# EAGLE design controller (EAGLE 5.12)
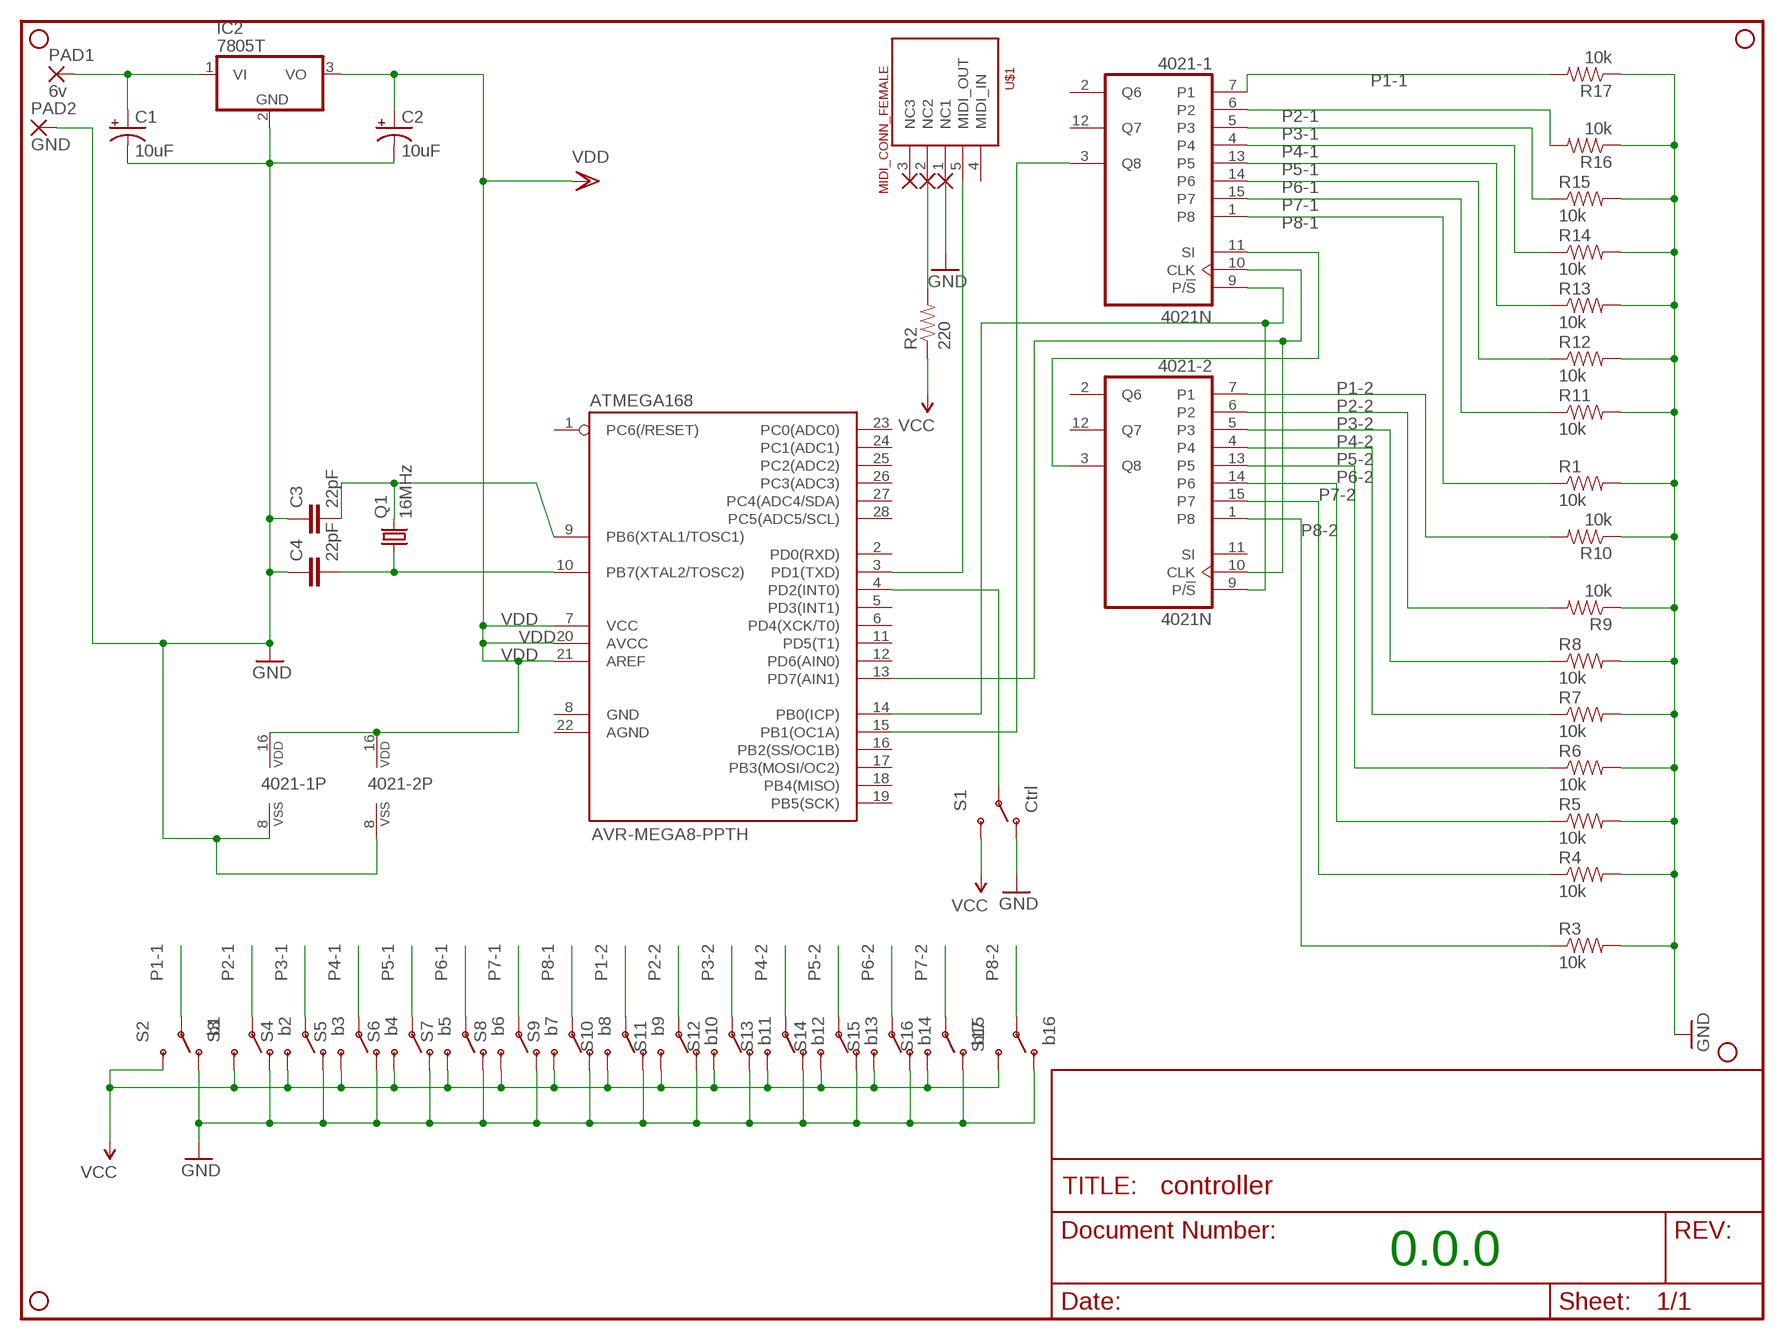
[diagram p0: schematic, sheet 1]

## Parts
4021-1  4021N  [DIL16]
4021-2  4021N  [DIL16]
ATMEGA168  AVR-MEGA8-PPTH  [DIL28-3]
C1  10uF  CAP_POLPTH2  [CPOL-RADIAL-10UF-25V]
C2  10uF  CAP_POLPTH2  [CPOL-RADIAL-10UF-25V]
C3  22pF  CAPKIT  [CAP-PTH-SMALL-KIT]
C4  22pF  CAPKIT  [CAP-PTH-SMALL-KIT]
IC2  7805T  [TO220H]
JP1  STAND-OFF  [STAND-OFF]
JP2  STAND-OFF  [STAND-OFF]
JP3  STAND-OFF  [STAND-OFF]
JP4  STAND-OFF  [STAND-OFF]
PAD1  6v  2,54/1,1  [2,54/1,1]
PAD2  GND  2,54/1,1  [2,54/1,1]
Q1  16MHz  CRYSTALHC49U70  [HC49U70]
R1  10k  RESISTORAXIAL-0.3  [AXIAL-0.3]
R2  220  RESISTORAXIAL-0.3  [AXIAL-0.3]
R3  10k  RESISTORAXIAL-0.3  [AXIAL-0.3]
R4  10k  RESISTORAXIAL-0.3  [AXIAL-0.3]
R5  10k  RESISTORAXIAL-0.3  [AXIAL-0.3]
R6  10k  RESISTORAXIAL-0.3  [AXIAL-0.3]
R7  10k  RESISTORAXIAL-0.3  [AXIAL-0.3]
R8  10k  RESISTORAXIAL-0.3  [AXIAL-0.3]
R9  10k  RESISTORAXIAL-0.3  [AXIAL-0.3]
R10  10k  RESISTORAXIAL-0.3  [AXIAL-0.3]
R11  10k  RESISTORAXIAL-0.3  [AXIAL-0.3]
R12  10k  RESISTORAXIAL-0.3  [AXIAL-0.3]
R13  10k  RESISTORAXIAL-0.3  [AXIAL-0.3]
R14  10k  RESISTORAXIAL-0.3  [AXIAL-0.3]
R15  10k  RESISTORAXIAL-0.3  [AXIAL-0.3]
R16  10k  RESISTORAXIAL-0.3  [AXIAL-0.3]
R17  10k  RESISTORAXIAL-0.3  [AXIAL-0.3]
S1  Ctrl  SWITCH-SPSTKIT  [SWITCH-SPDT_KIT]
S2  b1  SWITCH-SPSTKIT  [SWITCH-SPDT_KIT]
S3  b2  SWITCH-SPSTKIT  [SWITCH-SPDT_KIT]
S4  b3  SWITCH-SPSTKIT  [SWITCH-SPDT_KIT]
S5  b4  SWITCH-SPSTKIT  [SWITCH-SPDT_KIT]
S6  b5  SWITCH-SPSTKIT  [SWITCH-SPDT_KIT]
S7  b6  SWITCH-SPSTKIT  [SWITCH-SPDT_KIT]
S8  b7  SWITCH-SPSTKIT  [SWITCH-SPDT_KIT]
S9  b8  SWITCH-SPSTKIT  [SWITCH-SPDT_KIT]
S10  b9  SWITCH-SPSTKIT  [SWITCH-SPDT_KIT]
S11  b10  SWITCH-SPSTKIT  [SWITCH-SPDT_KIT]
S12  b11  SWITCH-SPSTKIT  [SWITCH-SPDT_KIT]
S13  b12  SWITCH-SPSTKIT  [SWITCH-SPDT_KIT]
S14  b13  SWITCH-SPSTKIT  [SWITCH-SPDT_KIT]
S15  b14  SWITCH-SPSTKIT  [SWITCH-SPDT_KIT]
S16  b15  SWITCH-SPSTKIT  [SWITCH-SPDT_KIT]
S17  b16  SWITCH-SPSTKIT  [SWITCH-SPDT_KIT]
U$1  MIDI_CONN_FEMALE  [DIN_5_FEMALE]

## Nets
GND: 4021-1.8(VSS) 4021-2.8(VSS) C1.2(-) C2.2(-) C3.1 C4.1 IC2.2(GND) PAD2.1(P) R1.P$2 R3.P$2 R4.P$2 R5.P$2 R6.P$2 R7.P$2 R8.P$2 R9.P$1 R10.P$1 R11.P$2 R12.P$2 R13.P$2 R14.P$2 R15.P$2 R16.P$1 R17.P$1 S1.1(O) S2.1(O) S3.1(O) S4.1(O) S5.1(O) S6.1(O) S7.1(O) S8.1(O) S9.1(O) S10.1(O) S11.1(O) S12.1(O) S13.1(O) S14.1(O) S15.1(O) S16.1(O) S17.1(O) U$1.1(NC1)
N$1: ATMEGA168.3(PD1(TXD)) U$1.5(MIDI_OUT)
N$2: R2.P$2 U$1.2(NC2)
N$3: ATMEGA168.4(PD2(INT0)) S1.2(P)
N$4: C1.1(+) IC2.1(VI) PAD1.1(P)
N$5: 4021-1.3(Q8) ATMEGA168.15(PB1(OC1A))
N$6: ATMEGA168.9(PB6(XTAL1/TOSC1)) C3.2 Q1.2
N$7: ATMEGA168.10(PB7(XTAL2/TOSC2)) C4.2 Q1.1
N$8: 4021-1.10(CLK) 4021-2.10(CLK) ATMEGA168.13(PD7(AIN1))
N$9: 4021-1.9(P/!S) 4021-2.9(P/!S) ATMEGA168.14(PB0(ICP))
N$10: 4021-1.11(SI) 4021-2.3(Q8)
P1-1: 4021-1.7(P1) R17.P$2 S2.2(P)
P1-2: 4021-2.7(P1) R10.P$2 S10.2(P)
P2-1: 4021-1.6(P2) R16.P$2 S3.2(P)
P2-2: 4021-2.6(P2) R9.P$2 S11.2(P)
P3-1: 4021-1.5(P3) R15.P$1 S4.2(P)
P3-2: 4021-2.5(P3) R8.P$1 S12.2(P)
P4-1: 4021-1.4 R14.P$1 S5.2(P)
P4-2: 4021-2.4 R7.P$1 S13.2(P)
P5-1: 4021-1.13(P5) R13.P$1 S6.2(P)
P5-2: 4021-2.13(P5) R6.P$1 S14.2(P)
P6-1: 4021-1.14(P6) R12.P$1 S7.2(P)
P6-2: 4021-2.14(P6) R5.P$1 S15.2(P)
P7-1: 4021-1.15(P7) R11.P$1 S8.2(P)
P7-2: 4021-2.15(P7) R4.P$1 S16.2(P)
P8-1: 4021-1.1(P8) R1.P$1 S9.2(P)
P8-2: 4021-2.1(P8) R3.P$1 S17.2(P)
VCC: R2.P$1 S1.3(S) S2.3(S) S3.3(S) S4.3(S) S5.3(S) S6.3(S) S7.3(S) S8.3(S) S9.3(S) S10.3(S) S11.3(S) S12.3(S) S13.3(S) S14.3(S) S15.3(S) S16.3(S) S17.3(S)
VDD: 4021-1.16(VDD) 4021-2.16(VDD) ATMEGA168.7(VCC) ATMEGA168.20(AVCC) ATMEGA168.21(AREF) C2.1(+) IC2.3(VO)
Unconnected: 4021-1.2(Q6) 4021-1.12(Q7) 4021-2.2(Q6) 4021-2.11(SI) 4021-2.12(Q7) ATMEGA168.1(PC6(/RESET)) ATMEGA168.2(PD0(RXD)) ATMEGA168.5(PD3(INT1)) ATMEGA168.6(PD4(XCK/T0)) ATMEGA168.8(GND) ATMEGA168.11(PD5(T1)) ATMEGA168.12(PD6(AIN0)) ATMEGA168.16(PB2(SS/OC1B)) ATMEGA168.17(PB3(MOSI/OC2)) ATMEGA168.18(PB4(MISO)) ATMEGA168.19(PB5(SCK)) ATMEGA168.22(AGND) ATMEGA168.23(PC0(ADC0)) ATMEGA168.24(PC1(ADC1)) ATMEGA168.25(PC2(ADC2)) ATMEGA168.26(PC3(ADC3)) ATMEGA168.27(PC4(ADC4/SDA)) ATMEGA168.28(PC5(ADC5/SCL)) U$1.3(NC3) U$1.4(MIDI_IN)

## Notes on the sheet
- 0.0.0

## Library data of the parts
4021-1 4021-2 = 40xx:4021: 8-bit static SHIFT REGISTER
ATMEGA168 = SparkFun:AVR-MEGA8-P: MICROCONTROLLER 8 Kbytes FLASH 1 kbytes SRAM 512 bytes EEPROM USART 4-channel 10 bit ADC 2-channel 8 bit ADC
C1 C2 = SparkFun:CAP_POL: Capacitor Polarized These are standard SMD and PTH capacitors. Normally 10uF, 47uF, and 100uF in electrolytic and tantalum varieties. Always verify the external diameter of the through hole cap, it varies with capacity, voltage, and manufacturer. The EIA devices should be standard.
C3 C4 = SparkFun:CAP: Capacitor Standard 0603 ceramic capacitor, and 0.1" leaded capacitor.
IC2 = linear:78*: Positive VOLTAGE REGULATOR Source: http://cache.national.com/ds/LM/LM78L05.pdf http://www.fairchildsemi.com/ds/LM/LM7805.pdf
JP1-JP4 = SparkFun:STAND-OFF: Stand Off This is the mechanical footprint for a #4 phillips button head screw. Use the keepout ring to avoid running the screw head into surrounding components. SKU : PRT-00447
PAD1 PAD2 = wirepad:2,54/1,1: THROUGH-HOLE PAD
Q1 = crystal:CRYSTAL: CRYSTAL; OC_FARNELL: unknown; OC_NEWARK: unknown
R1-R17 = SparkFun:RESISTOR: Resistor Basic schematic elements and footprints for 0603, 1206, and PTH resistors.
S1-S17 = SparkFun:SWITCH-SPST: SPST Switch Simple slide switch. Spark Fun Electronics SKU : COM-00102
U$1 = SparkFun:MIDI_CONN_FEMALE

## Board
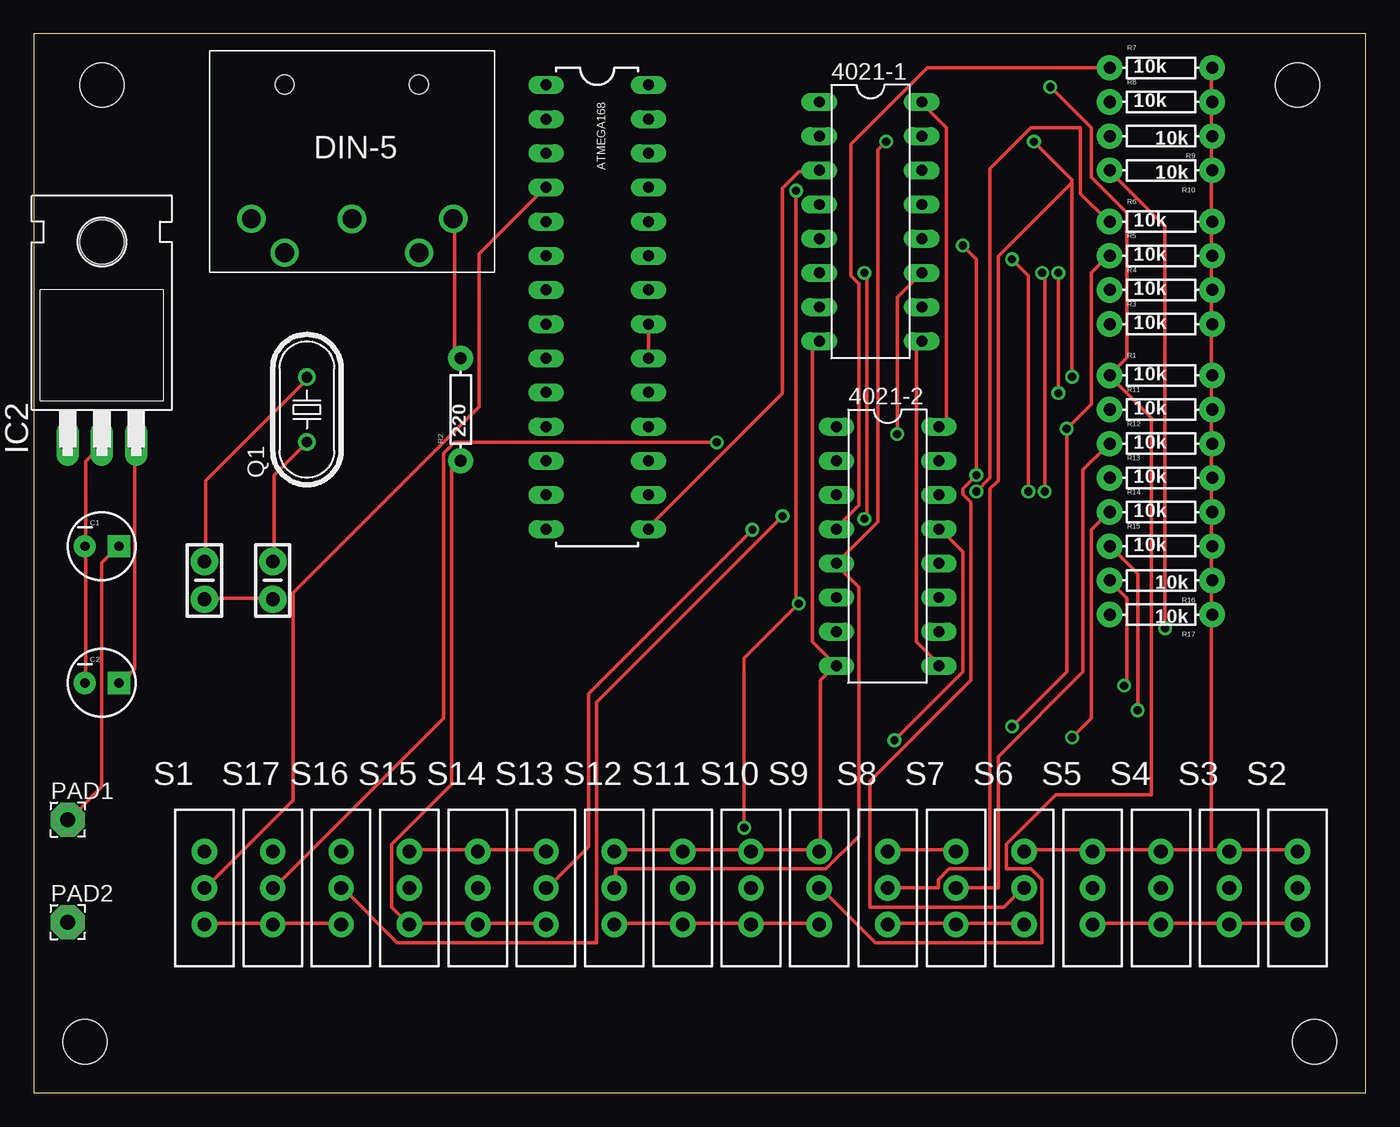
[diagram p1: board, top side]
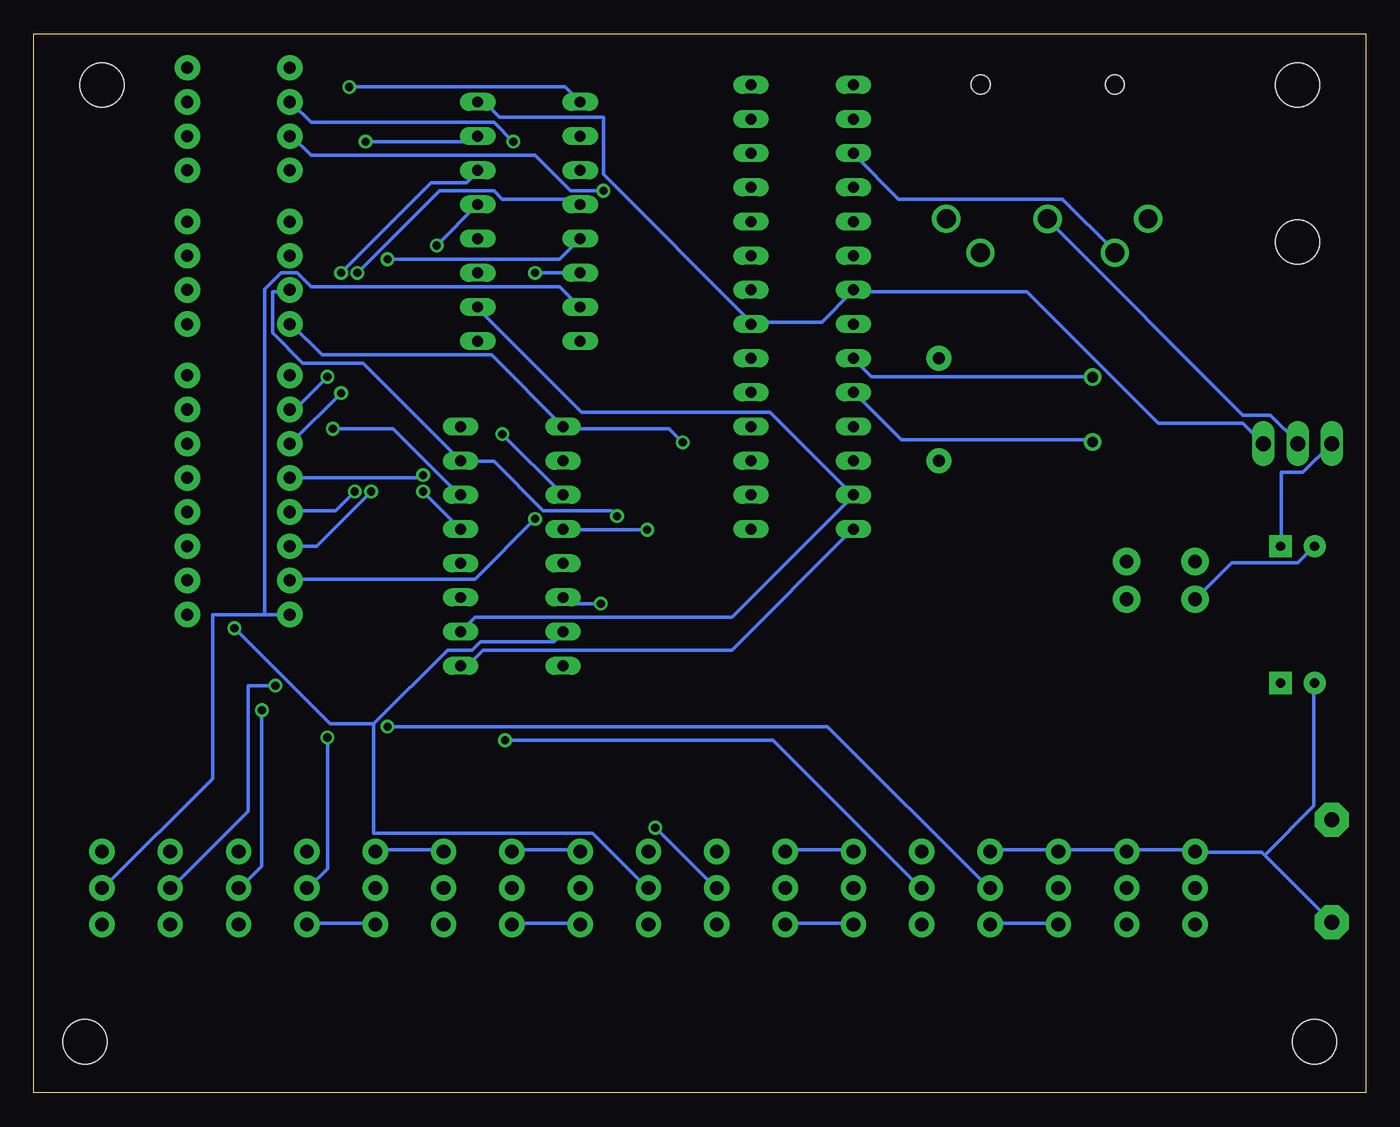
[diagram p2: board, bottom side, seen from below]

Size 99.06 x 78.74 mm. Coordinates in mm from the lower left corner, seen from the top.
Outline: 0,0 99.06,0 99.06,78.74 0,78.74 0,0
Copper layers (1*16): Top 0.035mm / dielectric 1.5mm / Bottom 0.035mm
Design rules "default": minimum track width 10mil, minimum drill 24mil, track to track 8mil, track to pad 8mil, pad to pad 8mil, via to via 8mil, smd to smd 8mil, copper to edge 40mil, drill to drill 8mil, minimum pad ring 10mil, minimum via ring 8mil, stop-mask expansion 4mil, vias tented up to drill 0mil, thermal gap 10mil

### Footprints (pad centres in the part's own frame; a part is rotated, then mirrored left to right if it is on the bottom)
DIL16 = drill 0.813 long: 1 -8.89,-3.81; 2 -6.35,-3.81; 3 -3.81,-3.81; 4 -1.27,-3.81; 5 1.27,-3.81; 6 3.81,-3.81; 7 6.35,-3.81; 8 8.89,-3.81; 9 8.89,3.81; 10 6.35,3.81; 11 3.81,3.81; 12 1.27,3.81; 13 -1.27,3.81; 14 -3.81,3.81; 15 -6.35,3.81; 16 -8.89,3.81
DIL28-3 = drill 0.813 long: 1 -16.51,-3.81; 2 -13.97,-3.81; 3 -11.43,-3.81; 4 -8.89,-3.81; 5 -6.35,-3.81; 6 -3.81,-3.81; 7 -1.27,-3.81; 8 1.27,-3.81; 9 3.81,-3.81; 10 6.35,-3.81; 11 8.89,-3.81; 12 11.43,-3.81; 13 13.97,-3.81; 14 16.51,-3.81; 15 16.51,3.81; 16 13.97,3.81; 17 11.43,3.81; 18 8.89,3.81; 19 6.35,3.81; 20 3.81,3.81; 21 1.27,3.81; 22 -1.27,3.81; 23 -3.81,3.81; 24 -6.35,3.81; 25 -8.89,3.81; 26 -11.43,3.81; 27 -13.97,3.81; 28 -16.51,3.81
CPOL-RADIAL-10UF-25V = drill 0.7 pad 1.651 square: 1 1.27,0 | drill 0.7 pad 1.651 round: 2 -1.27,0
CAP-PTH-SMALL-KIT = drill 1.016 pad 2.032 round: 1 -1.397,0; 2 1.397,0
TO220H = drill 1.118 long: 1 -2.54,-10.16; 2 0,-10.16; 3 2.54,-10.16 | hole 3.302: 0,4.826
STAND-OFF = hole 3.302: 0,0
2,54/1,1 = drill 1.118 pad 2.54 octagon: 1 0,0
HC49U70 = drill 0.813 round: 1 -2.413,0; 2 2.413,0
AXIAL-0.3 = drill 0.9 pad 1.88 round: P$1 -3.81,0; P$2 3.81,0
SWITCH-SPDT_KIT = drill 1.016 pad 1.88 round: 1 0,2.718; 2 0,0; 3 0,-2.718
DIN_5_FEMALE = drill 1.4 round: 1 0.46,3.61; 2 -7.07,3.6; 3 7.94,3.6; 4 -4.53,6.12; 5 5.47,6.13 | hole 1.4: -4.52,-6.38; 5.47,-6.38

### Placement (x,y rotation side)
4021-1  62.23,64.77 270 top
4021-2  63.5,40.64 270 top
ATMEGA168  41.91,58.42 270 top
C1  5.08,40.64 0 top
C2  5.08,30.48 0 top
C3  12.7,38.1 90 top
C4  17.78,38.1 90 top
IC2  5.08,58.42 0 top
JP1  3.81,3.81 0 top
JP2  93.98,74.93 0 top
JP3  95.25,3.81 0 top
JP4  5.08,74.93 0 top
PAD1  2.54,20.32 0 top
PAD2  2.54,12.7 0 top
Q1  20.32,50.8 90 top
R1  83.82,53.34 0 top
R2  31.75,50.8 90 top
R3  83.82,57.15 0 top
R4  83.82,59.69 0 top
R5  83.82,62.23 0 top
R6  83.82,64.77 0 top
R7  83.82,76.2 0 top
R8  83.82,73.66 0 top
R9  83.82,71.12 180 top
R10  83.82,68.58 180 top
R11  83.82,50.8 0 top
R12  83.82,48.26 0 top
R13  83.82,45.72 0 top
R14  83.82,43.18 0 top
R15  83.82,40.64 0 top
R16  83.82,38.1 180 top
R17  83.82,35.56 180 top
S1  12.7,15.24 0 top
S2  93.98,15.24 0 top
S3  88.9,15.24 0 top
S4  83.82,15.24 0 top
S5  78.74,15.24 0 top
S6  73.66,15.24 0 top
S7  68.58,15.24 0 top
S8  63.5,15.24 0 top
S9  58.42,15.24 0 top
S10  53.34,15.24 0 top
S11  48.26,15.24 0 top
S12  43.18,15.24 0 top
S13  38.1,15.24 0 top
S14  33.02,15.24 0 top
S15  27.94,15.24 0 top
S16  22.86,15.24 0 top
S17  17.78,15.24 0 top
U$1  24.13,68.58 180 top

### Tracks (layer width: path | path; a pad name or v marks a point on that pad's centre or on a via)
GND
  Top 0.254: C3.1 12.8,36.78 17.68,36.78 C4.1 | 3.86,40.64 3.86,30.48 C2.2 | 3.86,40.64 3.86,46.94 5.08,48.16 IC2.2 | 3.86,40.64 C1.2 | S12.1 43.28,18.09 48.16,18.09 S11.1 48.36,18.09 53.24,18.09 S10.1 53.44,18.09 58.32,18.09 S9.1 58.52,18.09 58.52,30.68 59.54,31.7 4021-2.8 57.91,33.53 57.91,55.47 58.32,55.88 4021-1.8 | S13.1 38,18.09 33.12,18.09 S14.1 32.92,18.09 28.04,18.09 S15.1 | 87.58,71.12 87.58,68.68 R10.P$1 87.58,68.48 87.58,64.82 R6.P$2 87.58,64.62 87.58,62.38 R5.P$2 87.58,62.18 87.58,59.74 R4.P$2 87.58,59.54 87.58,57.3 R3.P$2 87.58,57.1 87.58,53.44 R1.P$2 87.58,53.24 87.58,50.8 | R7.P$2 87.58,76.2 87.58,73.76 R8.P$2 87.58,73.56 87.58,71.12 | 87.58,71.12 R9.P$1 | 87.58,45.72 87.58,48.16 R12.P$2 87.58,48.36 87.58,50.8 | 87.58,35.56 87.58,38 R16.P$1 87.58,38.2 87.58,40.64 | 87.58,40.64 87.58,43.08 R14.P$2 87.58,43.28 87.58,45.72 | 87.58,40.64 R15.P$2 | 87.58,45.72 R13.P$2 | 87.58,50.8 R11.P$2 | 87.58,18.09 88.8,18.09 S3.1 89,18.09 93.88,18.09 S2.1 | 87.58,18.09 83.92,18.09 S4.1 83.72,18.09 78.84,18.09 S5.1 78.64,18.09 73.76,18.09 S6.1 | S8.1 63.6,18.09 68.48,18.09 S7.1 | 87.58,18.09 87.58,35.56 | 87.58,35.56 R17.P$1
  Bottom 0.254: U$1.1 23.57,64.82 9.14,50.39 7.11,50.39 5.08,48.36 IC2.2 | C3.1 12.6,36.78 9.96,39.42 5.08,39.42 3.86,40.64 C1.2 | S15.1 27.84,18.09 22.96,18.09 S16.1 22.76,18.09 17.88,18.09 S17.1 17.68,18.09 12.8,18.09 S1.1 12.6,17.88 7.72,17.88 7.52,17.68 | PAD2.1 7.52,17.68 | S12.1 43.08,18.09 38.2,18.09 S13.1 | S8.1 63.4,18.09 58.52,18.09 S9.1 | S6.1 73.56,18.09 68.68,18.09 S7.1 | 7.52,17.68 3.86,21.34 3.86,30.48 C2.2
N$1
  Bottom 0.254: ATMEGA168.3 38,69.7 34.75,66.45 22.55,66.45 18.69,62.59 U$1.5
N$2
  Top 0.254: R2.P$2 31.29,55.07 31.29,64.82 U$1.2
N$3
  Top 0.254: ATMEGA168.4 38,67.26 33.12,62.38 33.12,51 19.3,37.19 19.3,21.74 12.8,15.24 S1.2
N$4
  Top 0.254: PAD1.1 2.64,20.32 5.08,22.76 5.08,39.42 6.3,40.64 C1.1
  Bottom 0.254: C1.1 6.3,40.64 6.3,46.13 4.67,46.13 IC2.1
N$5
  Top 0.254: ATMEGA168.15 45.72,42.06 55.68,52.02 55.68,67.26 56.9,68.48 58.32,68.48 4021-1.3
N$6
  Top 0.254: Q1.2 20.32,53.03 12.8,45.52 12.8,39.62 C3.2
  Bottom 0.254: ATMEGA168.9 38,54.46 36.78,53.24 20.32,53.24 Q1.2
N$7
  Top 0.254: Q1.1 20.32,48.36 17.88,45.92 17.88,39.62 C4.2
  Bottom 0.254: ATMEGA168.10 38,52.02 34.54,48.56 20.32,48.56 Q1.1
N$8
  Bottom 0.254: 4021-2.10 66.24,35.36 47.14,35.36 38.2,44.3 ATMEGA168.13 38.2,44.5 44.3,50.6 58.32,50.6 66.04,58.32 4021-1.10
N$9
  Top 0.254: 4021-1.9 65.63,55.47 65.63,33.53 67.26,31.9 4021-2.9
  Bottom 0.254: ATMEGA168.14 38.2,41.86 47.14,32.92 65.63,32.92 66.65,31.9 67.26,31.9 4021-2.9
N$10  (via drill 0.61)
  Top 0.254: v64.21,48.97 64.21,59.13 4021-1.11
  Bottom 0.254: 4021-2.3 v64.21,48.97
P1-1
  Bottom 0.254: 81.89,35.56 81.89,59.74 80.67,60.96 79.45,60.96 78.44,59.94 59.94,59.94 4021-1.7 | 81.89,35.56 R17.P$2 | 81.89,35.56 85.75,35.56 85.75,23.37 93.88,15.24 S2.2
P1-2  (via drill 0.61)
  Top 0.254: v84.12,34.54 84.12,64.41 80.06,68.48 R10.P$2
  Bottom 0.254: 73.76,27.43 68.28,32.92 66.45,32.92 65.84,33.53 60.35,33.53 59.74,34.14 4021-2.7 | 73.76,27.43 73.76,19.3 57.51,19.3 53.44,15.24 S10.2 | v84.12,34.54 77.01,27.43 73.76,27.43
P2-1  (via drill 0.61)
  Top 0.254: v61.77,60.96 61.98,60.76 61.98,42.88 v61.77,42.67 | v81.08,30.28 81.28,30.48 81.28,36.78 80.06,38 R16.P$2
  Bottom 0.254: v61.77,42.67 66.24,38.2 79.86,38.2 R16.P$2 | v61.77,60.96 4021-1.6 | v81.08,30.28 83.11,30.28 83.11,20.93 88.8,15.24 S3.2
P2-2  (via drill 0.61)
  Top 0.254: 56.69,36.17 52.83,32.31 v52.83,19.71 | 56.69,36.17 v56.69,67.06 | 56.69,36.17 v56.9,36.37
  Bottom 0.254: v56.9,36.37 59.13,36.37 59.54,36.78 4021-2.6 | v52.83,19.71 48.36,15.24 S11.2 | v56.69,67.06 59.13,67.06 61.77,69.7 78.44,69.7 79.86,71.12 R9.P$2
P3-1  (via drill 0.61)
  Top 0.254: v72.75,61.98 73.97,60.76 v73.97,44.7 | v82.09,28.45 82.09,38.61 80.06,40.64 R15.P$1
  Bottom 0.254: v72.75,61.98 59.94,61.98 4021-1.5 | v73.97,44.7 78.03,40.64 R15.P$1 | v82.09,28.45 82.09,16.87 83.72,15.24 S4.2
P3-2  (via drill 0.61)
  Top 0.254: S12.2 43.28,15.24 43.28,16.66 58.93,16.66 61.37,19.1 61.37,37.59 59.74,39.22 4021-2.5 62.79,42.47 62.79,70.1 v63.4,70.71
  Bottom 0.254: v63.4,70.71 64.82,72.14 78.44,72.14 79.86,73.56 R8.P$1
P4-1  (via drill 0.61)
  Top 0.254: v74.98,60.96 75.18,60.76 v75.18,44.7 | v77.22,26.42 78.64,27.84 78.64,41.86 79.86,43.08 R14.P$1
  Bottom 0.254: v74.98,60.96 68.89,67.06 64.82,67.06 64.21,66.45 58.93,66.45 58.52,66.04 4021-1.4 | v75.18,44.7 76.61,43.28 79.86,43.28 R14.P$1 | v77.22,26.42 77.22,16.66 78.64,15.24 S5.2
P4-2  (via drill 0.61)
  Top 0.254: 4021-2.4 59.74,42.06 61.37,43.69 61.37,60.15 60.76,60.76 60.76,70.51 66.45,76.2 R7.P$1 | v53.44,41.86 41.25,29.67 41.25,18.29 38.2,15.24 S13.2
  Bottom 0.254: v53.44,41.86 59.54,41.86 4021-2.4
P5-1  (via drill 0.61)
  Top 0.254: v69.09,62.99 70.1,61.98 v70.1,45.92 69.09,44.91 69.09,44.5 69.7,43.89 69.7,30.68 62.18,23.16 62.18,13.82 72.14,13.82 73.56,15.24 S6.2
  Bottom 0.254: v69.09,62.99 4021-1.13 | v70.1,45.92 70.31,45.72 R13.P$1
P5-2  (via drill 0.61)
  Top 0.254: v70.1,44.7 71.12,45.72 71.12,68.68 74.17,71.73 77.83,71.73 77.83,66.85 79.86,64.82 R6.P$1 | v64.01,26.21 69.09,31.29 69.09,40.23 67.46,41.86 4021-2.13
  Bottom 0.254: 4021-2.13 v70.1,44.7 | v64.01,26.21 44.09,26.21 33.12,15.24 S14.2
P6-1  (via drill 0.61)
  Top 0.254: v76.2,52.02 v76.2,60.96 | S7.2 71.73,15.24 71.73,24.99 78.03,31.29 78.03,46.33 79.86,48.16 R12.P$1
  Bottom 0.254: v76.2,60.96 69.49,67.67 66.85,67.67 66.04,68.48 4021-1.14 | v76.2,52.02 79.86,48.36 R12.P$1
P6-2  (via drill 0.61)
  Top 0.254: R5.P$1 79.86,62.18 78.64,60.96 78.64,51.21 v76.81,49.38 76.81,31.29 v72.75,27.23
  Bottom 0.254: v76.81,49.38 72.34,49.38 67.46,44.5 4021-2.14 | v72.75,27.23 40.03,27.23 28.04,15.24 S15.2
P7-1  (via drill 0.61)
  Top 0.254: v74.37,70.71 77.22,67.87 77.22,67.67 | 77.22,67.67 v77.22,53.24 | 77.22,67.67 71.73,62.18 71.73,45.52 71.12,44.91 71.12,16.66 68.07,16.66 67.26,15.85 67.26,15.24 S8.2
  Bottom 0.254: 4021-1.15 66.45,70.71 v74.37,70.71 | v77.22,53.24 79.65,50.8 R11.P$1
P7-2  (via drill 0.61)
  Top 0.254: v55.68,42.88 41.86,29.06 41.86,11.18 27.03,11.18 22.96,15.24 S16.2
  Bottom 0.254: R4.P$1 80.06,59.54 81.28,59.54 81.28,56.49 79.05,54.25 74.57,54.25 4021-2.15 67.26,46.94 64.82,46.94 61.16,43.28 56.08,43.28 v55.68,42.88
P8-1  (via drill 0.61)
  Top 0.254: v75.59,74.78 78.64,71.73 78.64,68.07 81.28,65.43 81.28,54.66 80.06,53.44 R1.P$1 80.06,53.24 83.11,50.19 83.11,22.15 76,22.15 72.34,18.49 72.34,16.66 74.17,16.66 74.98,15.85 74.98,11.18 62.59,11.18 58.52,15.24 S9.2
  Bottom 0.254: v75.59,74.78 59.54,74.78 4021-1.1
P8-2  (via drill 0.61)
  Top 0.254: v50.8,48.36 31.29,48.36 30.48,47.55 30.48,27.84 17.88,15.24 S17.2
  Bottom 0.254: R3.P$1 79.86,57.1 77.62,54.86 65.02,54.86 4021-2.1 59.54,49.38 51.82,49.38 v50.8,48.36
VCC
  Top 0.254: S2.3 93.88,12.6 89,12.6 S3.3 88.8,12.6 83.92,12.6 S4.3 83.72,12.6 78.84,12.6 S5.3 | S8.3 63.6,12.6 68.48,12.6 S7.3 68.68,12.6 73.56,12.6 S6.3 | S9.3 58.32,12.6 53.44,12.6 S10.3 53.24,12.6 48.36,12.6 S11.3 48.16,12.6 43.28,12.6 S12.3 | S13.3 38,12.6 33.12,12.6 S14.3 32.92,12.6 28.04,12.6 S15.3 27.84,12.6 26.62,13.82 26.62,18.49 31.09,22.96 31.09,46.33 R2.P$1 | S1.3 12.8,12.6 17.68,12.6 S17.3 17.88,12.6 22.76,12.6 S16.3
  Bottom 0.254: S6.3 73.76,12.6 78.64,12.6 S5.3 | S16.3 22.96,12.6 27.84,12.6 S15.3 | S12.3 43.08,12.6 38.2,12.6 S13.3 | S8.3 63.4,12.6 58.52,12.6 S9.3
VDD
  Top 0.254: C2.1 6.5,30.48 7.52,31.5 7.52,48.16 IC2.3 | ATMEGA168.21 ATMEGA168.20 | 4021-2.16 67.46,49.58 67.87,49.99 67.87,71.73 66.04,73.56 4021-1.16
  Bottom 0.254: 45.72,57.3 40.44,57.3 38.2,59.54 ATMEGA168.7 38,59.54 25.2,59.54 15.44,49.78 9.14,49.78 IC2.3 | 45.72,57.3 56.69,68.28 56.69,72.54 64.41,72.54 65.43,73.56 66.04,73.56 4021-1.16 | 45.72,57.3 ATMEGA168.21